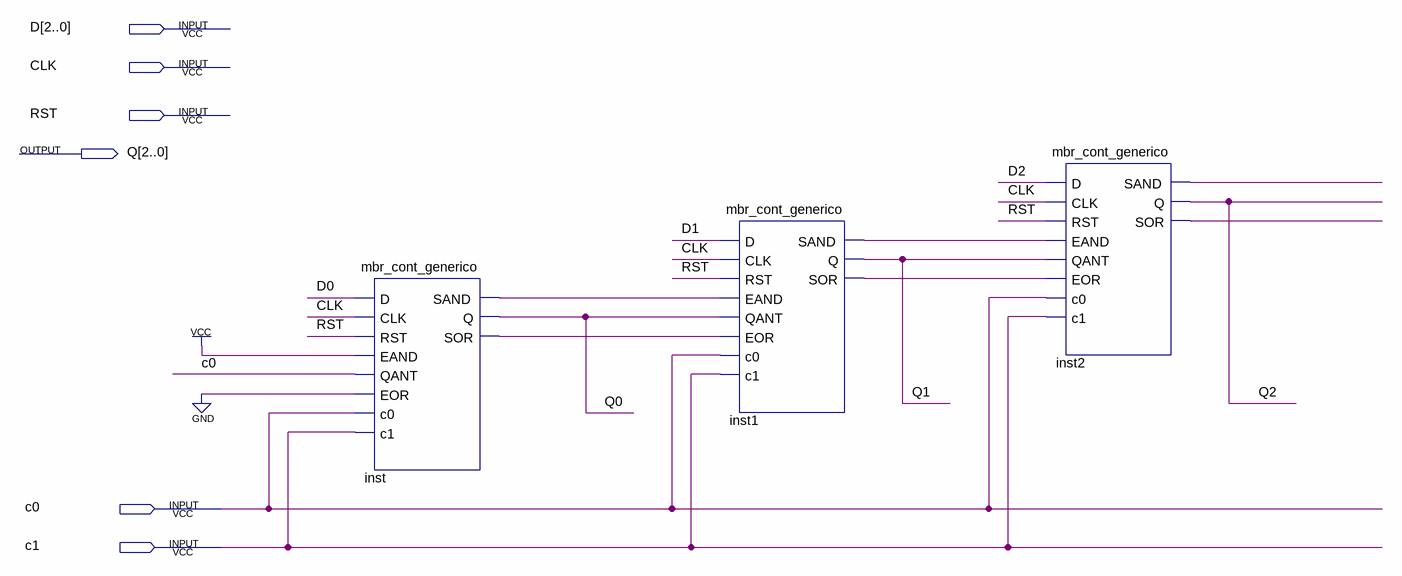
[diagram p0: schematic sheet]
// Quartus schematic mbr_cont_3b.bdf as structural Verilog: 3 symbols, 6 pins
module mbr_cont_3b (
  input  [2:0] D,
  input  CLK,
  input  RST,
  input  c0,
  input  c1,
  output [2:0] Q
);

  wire inst1_sand, inst1_sor, inst2_sand, inst2_sor, inst_sand, inst_sor;

  mbr_cont_generico inst (
    .D(D[0]), .CLK(CLK), .RST(RST), .EAND(1'b1), .QANT(c0), .EOR(1'b0), .c0(c0), .c1(c1), .SAND(inst_sand),
    .Q(Q[0]), .SOR(inst_sor));
  mbr_cont_generico inst1 (
    .D(D[1]), .CLK(CLK), .RST(RST), .EAND(inst_sand), .QANT(Q[0]), .EOR(inst_sor), .c0(c0), .c1(c1),
    .SAND(inst1_sand), .Q(Q[1]), .SOR(inst1_sor));
  mbr_cont_generico inst2 (
    .D(D[2]), .CLK(CLK), .RST(RST), .EAND(inst1_sand), .QANT(Q[1]), .EOR(inst1_sor), .c0(c0), .c1(c1),
    .SAND(inst2_sand), .Q(Q[2]), .SOR(inst2_sor));
endmodule
